# EAGLE design tritiled_nocell (EAGLE 7.3.0)
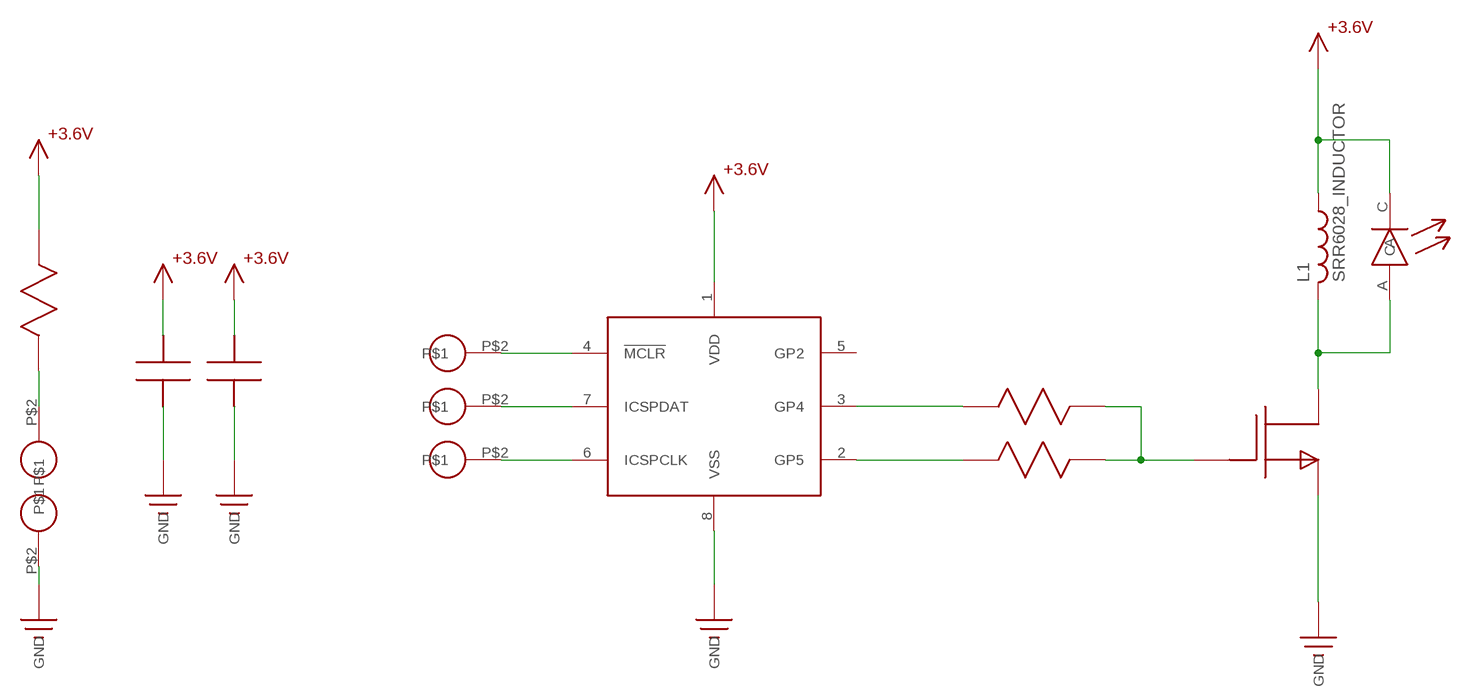
[diagram p0: schematic, sheet 1]

## Parts
L1  SRR6028_INDUCTOR  [SRR6028_INDUCTOR]
U$1  PIC12LF1571  [SOIC8]
U$7  ICSP_PAD  [ICSP_PAD]
U$9  ICSP_PAD  [ICSP_PAD]
U$10  R1206  [R1206]
U$12  LED_3W  [LED_3W]
U$16  ZXMN3B01FSOT23  [SOT-23]
U$17  ICSP_PAD  [ICSP_PAD]
U$18  ICSP_PAD  [ICSP_PAD]
U$19  ICSP_PAD  [ICSP_PAD]
U$20  C1206  [1206]
U$21  C0603  [C0603]
U$22  R0603  [R0603]
U$23  R0603  [R0603]

## Nets
+3.3V: L1.P$1 U$1.1(VDD) U$10.P$1 U$12.C U$20.P$1 U$21.P$1 ; supply symbol labelled +3.6V
GND: U$1.8(VSS) U$9.P$2 U$16.2(S) U$20.P$2 U$21.P$2
N$1: U$1.4(!MCLR!) U$18.P$2
N$2: U$7.P$2 U$10.P$2
N$3: U$1.7(ICSPDAT) U$19.P$2
N$4: U$1.6(ICSPCLK) U$17.P$2
N$5: L1.P$2 U$12.A U$16.3(D)
N$6: U$1.3(GP4) U$23.P$1
N$7: U$1.2(GP5) U$22.P$1
N$8: U$16.1(G) U$22.P$2 U$23.P$2
Unconnected: U$1.5(GP2)

## Library data of the parts
L1 = tritiled:SRR6028_INDUCTOR
U$1 = tritiled:PIC12LF1571
U$7 U$9 U$17-U$19 = tritiled:ICSP_PAD
U$10 U$22 U$23 = tritiled:R
U$12 = tritiled:LED_3W
U$16 = tritiled:ZXMN3B01F
U$20 U$21 = tritiled:C

## Board
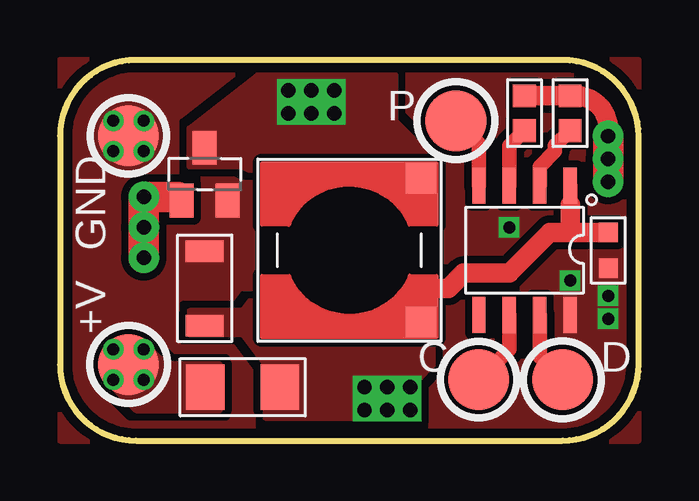
[diagram p1: board, top side]
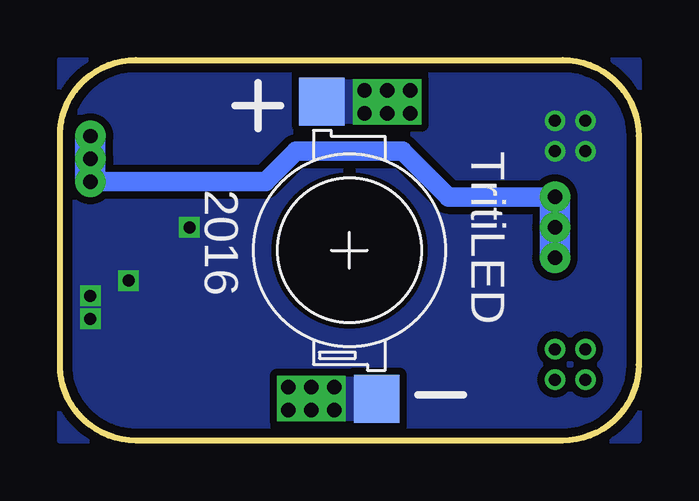
[diagram p2: board, bottom side, seen from below]

Size 24.13 x 15.88 mm. Coordinates in mm from the lower left corner, seen from the top.
Outline: 3.17,15.88 arc90 0,12.7 0,3.17 arc90 3.17,0 20.95,0 arc90 24.13,3.17 24.13,12.7 arc90 20.95,15.88 3.17,15.88
Copper layers (1*16): Top 0.0356mm / dielectric 1.5011mm / Bottom 0.0356mm
Design rules "LaenPCBOrder_tented_vias_12mil": minimum track width 8mil, minimum drill 13mil, track to track 12mil, track to pad 12mil, pad to pad 12mil, via to via 12mil, smd to smd 12mil, copper to edge 15mil, drill to drill 6mil, minimum pad ring 7mil, minimum via ring 7mil, stop-mask expansion 4mil, vias tented up to drill 28mil, thermal gap 10mil

### Footprints (pad centres in the part's own frame; a part is rotated, then mirrored left to right if it is on the bottom)
SRR6028_INDUCTOR = smd 1.27 x 1.27: P$1 -3,3; P$2 -3,-3
SOIC8 = smd 0.55 x 1.5: 1 -1.905,-2.7; 2 -0.635,-2.7; 3 0.635,-2.7; 4 1.905,-2.7; 5 1.905,2.7; 6 0.635,2.7; 7 -0.635,2.7; 8 -1.905,2.7
ICSP_PAD = smd 2.54 x 2.54: P$2 0,0
R1206 = smd 1.6 x 1.9: P$1 -1.55,0; P$2 1.55,0
LED_3W = smd 2 x 1.9: A 6.2,1.15; C -6.2,-1.15
SOT-23 = smd 1 x 1.4: 1 -0.95,-1.1; 2 0.95,-1.1; 3 0,1.1
1206 = smd 0.9 x 1.6: P$1 -1.55,0; P$2 1.55,0
C0603 = smd 0.8 x 0.8: P$1 -0.75,0; P$2 0.75,0
R0603 = smd 0.95 x 0.95: P$1 -0.725,0; P$2 0.725,0

### Placement (x,y rotation side)
L1  12.06,7.94 180 top
U$1  19.37,7.94 180 top
U$7  2.86,3.17 0 top
U$9  2.86,12.7 0 top
U$10  7.62,2.22 180 top
U$12  12.06,7.94 90 bottom
U$16  6.03,11.11 0 top
U$17  17.46,2.54 0 top
U$18  16.51,13.34 0 top
U$19  20.95,2.54 0 top
U$20  6.03,6.35 90 top
U$21  22.86,7.94 270 top
U$22  21.27,13.65 90 top
U$23  19.37,13.65 90 top

### Tracks (layer width: path | path; a pad name or v marks a point on that pad's centre or on a via)
+3.3V  (via drill 0.6)
  Top 0.61: U$1.1 21.27,9.84
  Top 0.813: U$21.P$1 21.27,8.69 | 21.27,8.69 20.43,8.69 18.73,6.99 16.83,6.99 16.19,6.35 15.24,6.35 15.24,5.11 L1.P$1 | 21.27,9.84 21.27,8.69
  other vias: 12.7,2.22 12.7,1.27 13.65,1.27 13.65,2.22 14.61,2.22 14.61,1.27
  pour Bottom (no thermals): 10.16,2.54 14.92,2.54 14.92,0.95 10.16,0.95
  pour Top (no thermals): 14.92,0.95 14.92,2.54 15.56,3.17 15.56,5.08 14.92,4.45 8.57,4.76 8.57,6.67 7.62,5.4 5.4,5.4 5.4,4.45 7.62,4.45 8.57,3.17 8.57,0.95
GND  (via drill 0.5)
  Top 0.305: v2.22,12.06 arc-90 U$9.P$2
  other vias: 2.22,13.34 3.49,13.34 3.49,12.06 21.27,6.67 22.86,6.03 22.86,5.08 18.73,8.89
  pour Bottom (no thermals): 0,0 24.13,0 24.13,15.88 0,15.88
  pour Top (rank 2, no thermals): 0,15.88 0,0 24.13,0 24.13,15.88
N$1
  Top 0.61: U$1.4 17.46,12.38 U$18.P$2
N$2  (via drill 0.5)
  Top 0.305: v2.22,3.81 arc90 U$7.P$2 | v3.49,3.81 arc-90 U$7.P$2 | v2.22,2.54 arc-90 U$7.P$2 | v3.49,2.54 arc90 U$7.P$2
  pour Top (no thermals): 6.67,3.17 5.08,3.17 4.45,3.17 3.81,3.81 2.22,3.81 2.22,2.22 3.17,1.27 6.67,1.27
N$3
  Top 0.61: U$1.7 20,3.49 U$19.P$2
N$4
  Top 0.61: U$1.6 18.73,3.81 U$17.P$2
N$5  (via drill 0.6)
  other vias: 11.43,14.61 11.43,13.65 10.48,13.65 9.53,13.65 9.53,14.61 10.48,14.61
  pour Bottom (no thermals): 9.21,14.92 13.97,14.92 13.97,13.34 9.21,13.34
  pour Top (no thermals): 8.26,15.24 13.97,15.24 13.97,13.34 15.56,11.75 15.56,11.11 8.26,11.11 7.62,11.43 5.4,11.43 5.4,13.02
N$6
  Top 0.61: U$1.3 18.73,12.29 U$23.P$1
N$7
  Top 0.61: U$1.2 20,11.43 20.64,12.06 20.64,12.29 U$22.P$1
N$8  (via drill 0.6 pad 1.27)
  Top 0.813: U$22.P$2 U$23.P$2 21.5,14.38 arc-90 22.86,13.02 v22.86,12.7 v22.86,11.75 v22.86,10.79 | v3.49,10.16 v3.49,8.89 v3.49,7.62 | U$16.1 4.93,10.16
  Top 1.27: 4.93,10.16 v3.49,10.16 v3.49,7.62 | v22.86,12.7 v22.86,10.79
  Bottom 0.813: v22.86,10.79 15.56,10.79 14.29,12.06 9.84,12.06 7.94,10.16 v3.49,10.16
  Bottom 1.27: v22.86,12.7 v22.86,10.79 | v3.49,10.16 v3.49,7.62

### Text on the board
tPlace: P | GND | +V | C | D
bPlace: TritiLED | 2016